# Altium project QUTMS_SteeringWheelV2-V01.PrjPcb
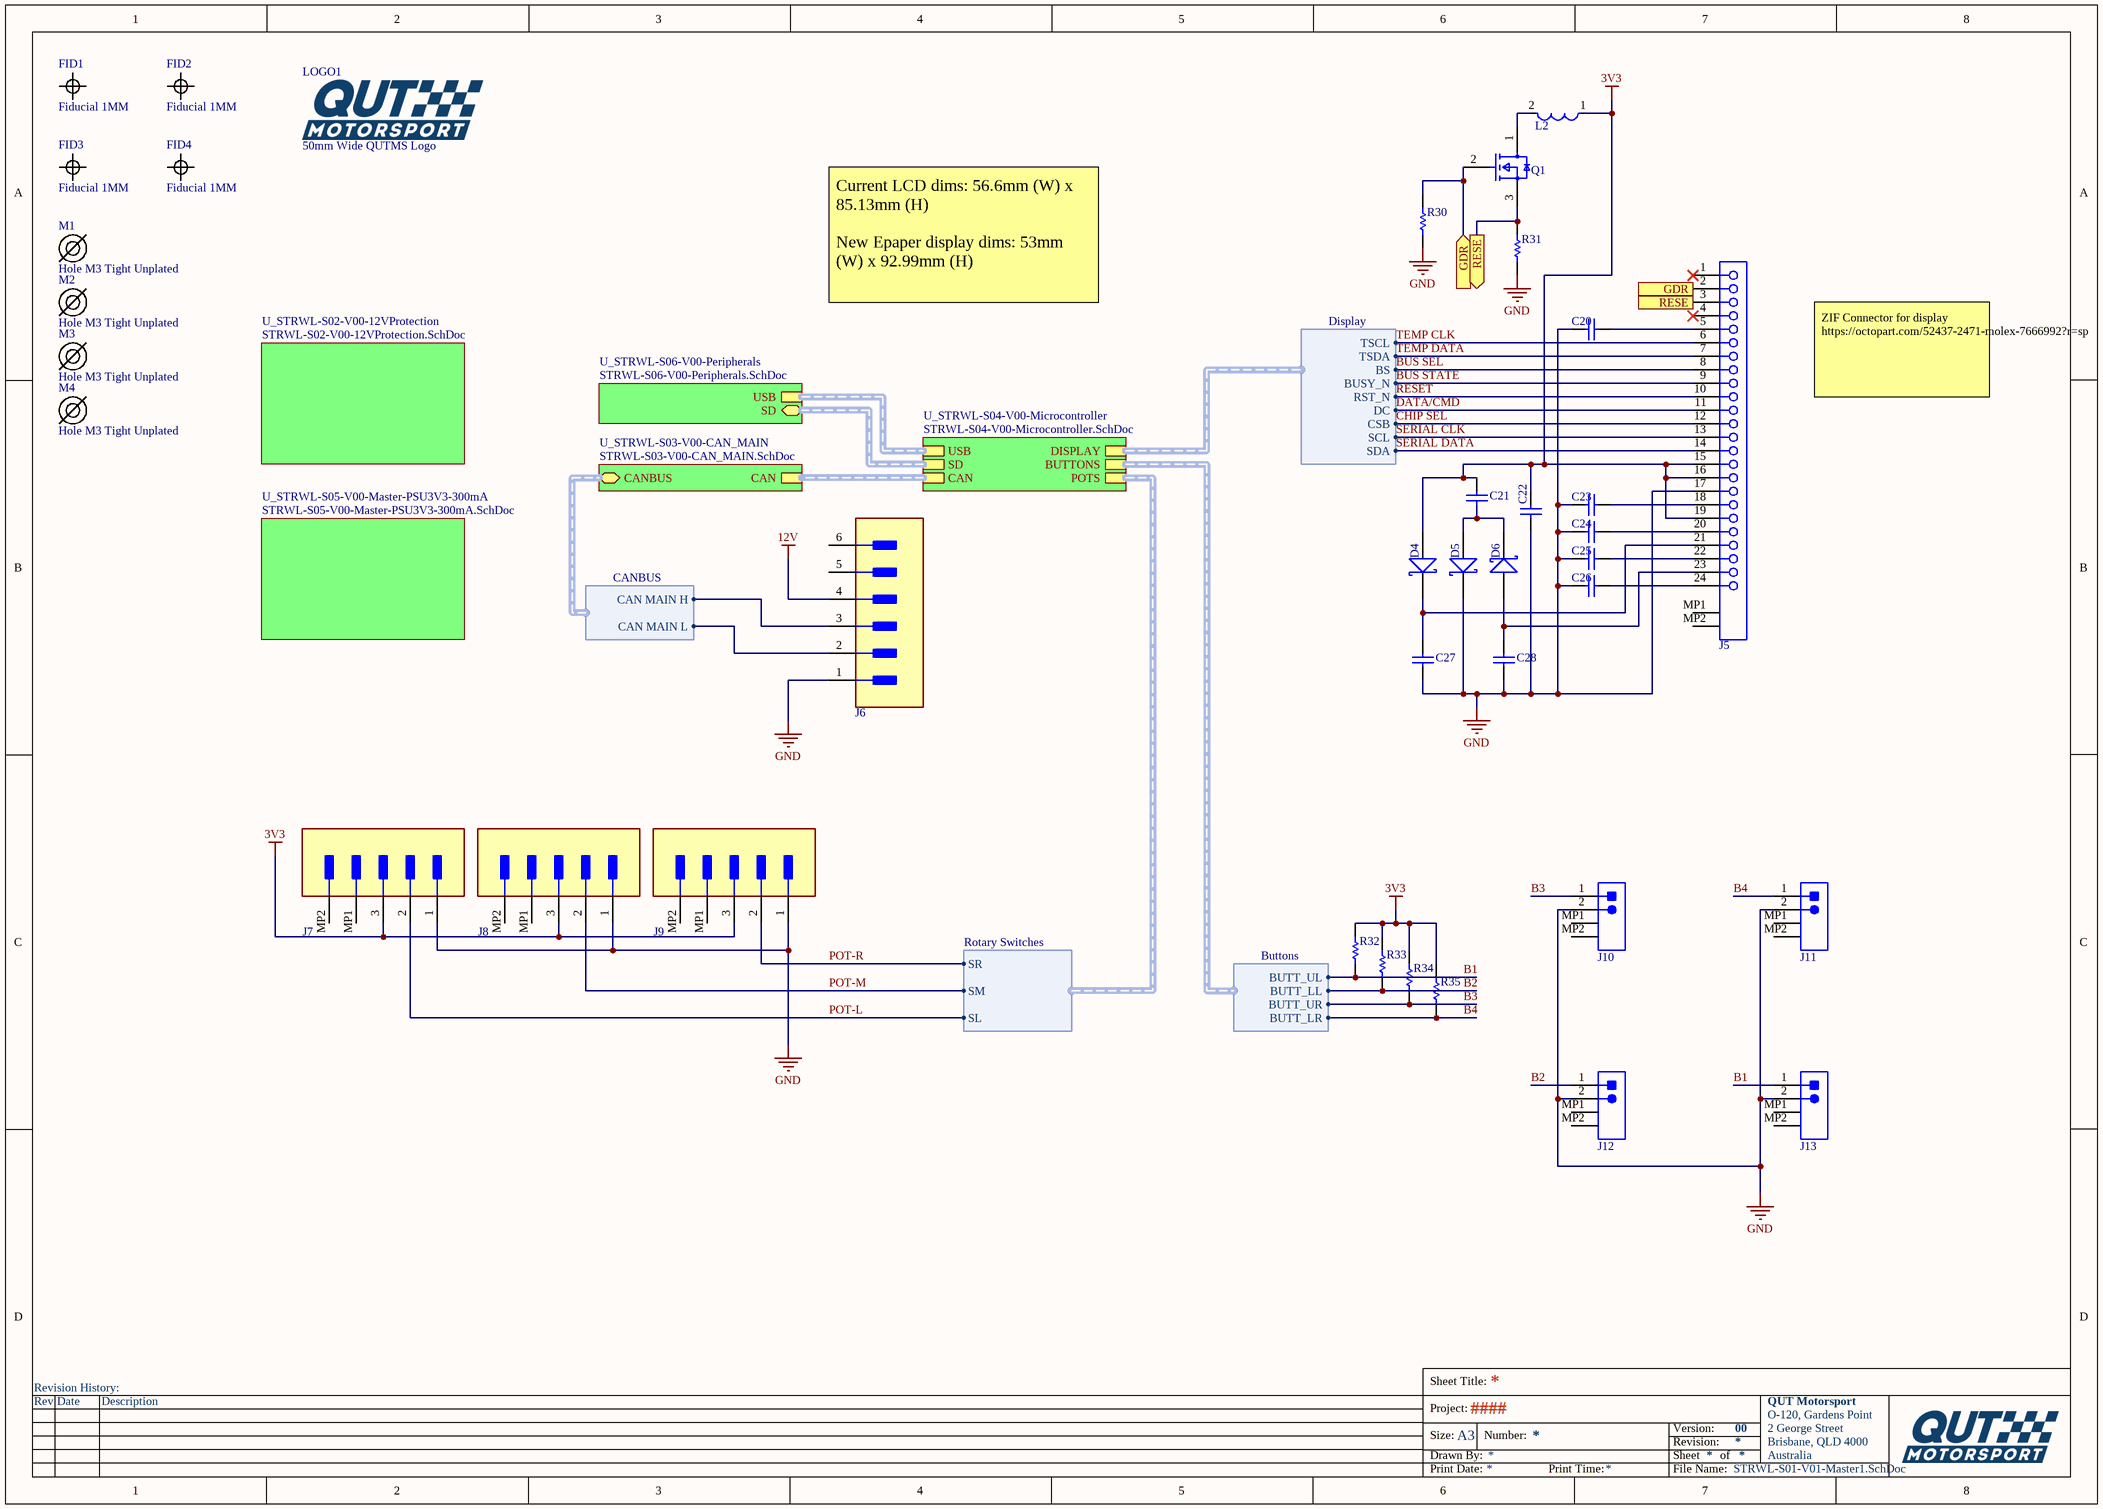
[diagram p0: STRWL-S01-V01-Master1.SchDoc]
4 sheets, 92 parts. Net scope: hierarchical (ports join the sheet entries above them; power ports are global).
Board file: STRWL-P01-V01.PcbDoc
Sheets:
  STRWL-S01-V01-Master1.SchDoc
    U_STRWL-S02-V00-12VProtection = STRWL-S02-V00-12VProtection.SchDoc
    U_STRWL-S03-V00-CAN_MAIN = STRWL-S03-V00-CAN_MAIN.SchDoc
    U_STRWL-S04-V00-Microcontroller = STRWL-S04-V00-Microcontroller.SchDoc

## Sheet STRWL-S01-V01-Master1.SchDoc
size A3; Version: 00; Project: ####; PageSetup: Record=PageOptions|CenterHorizontal=True|CenterVertical=True|PrintScale=0.97|XCorrection=1.00|YCorrection=1.00|PrintKind=0|BorderSize=5000000|LeftOffset=0|BottomOffset=0|Orientation=2|PaperLength=1000|PaperWidth=1000|Scale=100|PaperSource=7|PrintQuality=-4|MediaType=1|DitherType=10|PaperKind=A4|PrintScaleMode=1

### Parts
C20  1uF 25V 5% X7R 0603  [Cap_Ceramic_0603]  (value not drawn)
C21  4u7 50V 5% X7R 0603  [Cap_Ceramic_0603]  (value not drawn)
C22  1uF 25V 5% X7R 0603  [Cap_Ceramic_0603]  (value not drawn)
C23  1uF 25V 5% X7R 0603  [Cap_Ceramic_0603]  (value not drawn)
C24  1uF 25V 5% X7R 0603  [Cap_Ceramic_0603]  (value not drawn)
C25  1uF 25V 5% X7R 0603  [Cap_Ceramic_0603]  (value not drawn)
C26  1uF 25V 5% X7R 0603  [Cap_Ceramic_0603]  (value not drawn)
C27  1uF 25V 5% X7R 0603  [Cap_Ceramic_0603]  (value not drawn)
C28  1uF 25V 5% X7R 0603  [Cap_Ceramic_0603]  (value not drawn)
D4  STPS0530Z  [SOD123]  (value not drawn)
D5  STPS0530Z  [SOD123]  (value not drawn)
D6  STPS0530Z  [SOD123]  (value not drawn)
FID1  Fiducial 1MM  [FIDUCIAL 1MM]  (no BOM)
FID2  Fiducial 1MM  [FIDUCIAL 1MM]  (no BOM)
FID3  Fiducial 1MM  [FIDUCIAL 1MM]  (no BOM)
FID4  Fiducial 1MM  [FIDUCIAL 1MM]  (no BOM)
J5  52437-2471  [MOLX-52437-2471]  (value not drawn)
J6  JST PH 4 Way SMD Header  [JST 4P SMD]  (value not drawn)
J7  JST PH 3 Way SMD Header  [JST 3P SMD]  (value not drawn)
J8  JST PH 3 Way SMD Header  [JST 3P SMD]  (value not drawn)
J9  JST PH 3 Way SMD Header  [JST 3P SMD]  (value not drawn)
J10  JST PH 2 Way SMD Header  [JST 2P SMD]  (value not drawn)
J11  JST PH 2 Way SMD Header  [JST 2P SMD]  (value not drawn)
J12  JST PH 2 Way SMD Header  [JST 2P SMD]  (value not drawn)
J13  JST PH 2 Way SMD Header  [JST 2P SMD]  (value not drawn)
L2  LQM21FN100M70L  [Murata_LQM21FN_70_IPC_C]  (value not drawn)
LOGO1  50mm Wide QUTMS Logo  [QUTMS LOGO 50MM]  (no BOM)
M1  Hole M3 Tight Unplated  [M3.2 UNPLATED]
M2  Hole M3 Tight Unplated  [M3.2 UNPLATED]
M3  Hole M3 Tight Unplated  [M3.2 UNPLATED]
M4  Hole M3 Tight Unplated  [M3.2 UNPLATED]
Q1  MOSFET N-CH 30V 4A SOT323  [Diodes_SOT323_0]  (value not drawn)
R30  10k 1% 0603  [Res_ThinFilm_0603]  (value not drawn)
R31  0R47 5% 0603  [Res_ThinFilm_0603]  (value not drawn)
R32  10k 5% 0603  [Res_ThinFilm_0603]  (value not drawn)
R33  10k 5% 0603  [Res_ThinFilm_0603]  (value not drawn)
R34  10k 5% 0603  [Res_ThinFilm_0603]  (value not drawn)
R35  10k 5% 0603  [Res_ThinFilm_0603]  (value not drawn)

### Sub-sheets
U_STRWL-S02-V00-12VProtection = STRWL-S02-V00-12VProtection.SchDoc: no entries
U_STRWL-S03-V00-CAN_MAIN = STRWL-S03-V00-CAN_MAIN.SchDoc: CANBUS (bidir, harness CANBUS), CAN (harness CAN)
U_STRWL-S04-V00-Microcontroller = STRWL-S04-V00-Microcontroller.SchDoc: CAN (harness CAN), USB (harness USB), SD (harness SD), DISPLAY (harness Display), BUTTONS (harness Buttons), POTS (harness Rotary Switches)
U_STRWL-S05-V00-Master-PSU3V3-300mA = STRWL-S05-V00-Master-PSU3V3-300mA.SchDoc (file not in this document): no entries
U_STRWL-S06-V00-Peripherals = STRWL-S06-V00-Peripherals.SchDoc (file not in this document): USB (harness USB), SD (bidir, harness SD)

### Ports
GDR (in), GDR (out), RESE (in), RESE (out)

### Harnesses
CANBUS: CAN MAIN H, CAN MAIN L
Display: CSB, SCL, SDA, TSCL, TSDA, BS, BUSY_N, RST_N, DC
Buttons: BUTT_UL, BUTT_LL, BUTT_UR, BUTT_LR
Rotary Switches: SL, SM, SR

### Nets
3V3: C21.2 C22.2 D4.A J5.15 J5.16 J5.19 J7.3 J8.3 J9.3 L2.1 R32.1 R33.1 R34.2 R35.2
12V: J6.4
GND: C20.1 C22.1 C23.1 C24.1 C25.1 C26.1 C27.1 C28.1 D5.K J5.17 J6.1 J7.1 J8.1 J9.1 J10.2 J11.2 J12.2 J13.2 R30.2 R31.1
B1: J13.1 R32.2 ; sheet U_STRWL-S04-V00-Microcontroller/BUTTONS.BUTT_UL
B2: J12.1 R33.2 ; sheet U_STRWL-S04-V00-Microcontroller/BUTTONS.BUTT_LL
B3: J10.1 R34.1 ; sheet U_STRWL-S04-V00-Microcontroller/BUTTONS.BUTT_UR
B4: J11.1 R35.1 ; sheet U_STRWL-S04-V00-Microcontroller/BUTTONS.BUTT_LR
BUS SEL: J5.8 ; sheet U_STRWL-S04-V00-Microcontroller/DISPLAY.BS
BUS STATE: J5.9 ; sheet U_STRWL-S04-V00-Microcontroller/DISPLAY.BUSY_N
CAN MAIN H: J6.3 ; sheet U_STRWL-S03-V00-CAN_MAIN/CANBUS.CAN MAIN H
CAN MAIN L: J6.2 ; sheet U_STRWL-S03-V00-CAN_MAIN/CANBUS.CAN MAIN L
CHIP SEL: J5.12 ; sheet U_STRWL-S04-V00-Microcontroller/DISPLAY.CSB
DATA/CMD: J5.11 ; sheet U_STRWL-S04-V00-Microcontroller/DISPLAY.DC
POT-L: J7.2 ; sheet U_STRWL-S04-V00-Microcontroller/POTS.SL
POT-M: J8.2 ; sheet U_STRWL-S04-V00-Microcontroller/POTS.SM
POT-R: J9.2 ; sheet U_STRWL-S04-V00-Microcontroller/POTS.SR
RESET: J5.10 ; sheet U_STRWL-S04-V00-Microcontroller/DISPLAY.RST_N
SERIAL CLK: J5.13 ; sheet U_STRWL-S04-V00-Microcontroller/DISPLAY.SCL
SERIAL DATA: J5.14 ; sheet U_STRWL-S04-V00-Microcontroller/DISPLAY.SDA
TEMP CLK: J5.6 ; sheet U_STRWL-S04-V00-Microcontroller/DISPLAY.TSCL
TEMP DATA: J5.7 ; sheet U_STRWL-S04-V00-Microcontroller/DISPLAY.TSDA
NetC20_2: C20.2 J5.5
NetC21_1: C21.1 D5.A D6.K
NetC23_2: C23.2 J5.18
NetC24_2: C24.2 J5.20
NetC25_2: C25.2 J5.22
NetC26_2: C26.2 J5.24
NetC27_2: C27.2 D4.K J5.21
NetC28_2: C28.2 D6.A J5.23
NetJ5_2: J5.2 Q1.2(G) R30.1 ; port GDR
NetJ5_3: J5.3 Q1.3(S) R31.2 ; port RESE
NetL2_2: L2.2 Q1.1(D)

Not connected (* = marked no-connect by the designer): J5 1* 4* MP1 MP2; J6 5(MNT_1) 6(MNT_2); J7 MP1(MNT_1) MP2(MNT_2); J8 MP1(MNT_1) MP2(MNT_2); J9 MP1(MNT_1) MP2(MNT_2); J10 MP1 MP2; J11 MP1 MP2; J12 MP1 MP2; J13 MP1 MP2

### Buses and harness runs
harness sheet U_STRWL-S03-V00-CAN_MAIN/CAN = sheet U_STRWL-S04-V00-Microcontroller/CAN
harness sheet U_STRWL-S04-V00-Microcontroller/SD = sheet U_STRWL-S06-V00-Peripherals/SD
harness sheet U_STRWL-S04-V00-Microcontroller/USB = sheet U_STRWL-S06-V00-Peripherals/USB

### Notes on the sheet
- Current LCD dims: 56.6mm (W) x 85.13mm (H)
  New Epaper display dims: 53mm (W) x 92.99mm (H)
- ZIF Connector for display
  https://octopart.com/52437-2471-molex-7666992?r=sp
- Revision History:
- Sheet Title:
- Rev
- Date
- Description
- Project:
- Size:
- Drawn By:
- A3
- Number:
- Revision:
- Sheet
- Version:
- of
- QUT Motorsport
- O-120, Gardens Point
- 2 George Street
- Brisbane, QLD 4000
- Australia
- Print Date:
- Print Time:
- File Name:

### Library data of the parts
C20 C22-C28 = 1uF 25V 5% X7R 0603: Capacitor, Ceramic, SMD, 1uF, 25V, 5%, X7R, 0603
C21 = 4u7 50V 5% X7R 0603: Capacitor, Ceramic, SMD, 4u7, 50V, 5%, X7R, 0603
D4-D6 = STPS0530Z: Diode, Schottky Barrier Rectifier, 30 V, 0.5 A, STPS0530Z
J5 = 52437-2471: 0.5 mm Pitch Easy-On(TM) Type FPC Connector, Right Angle, ZIF, SMT, Bottom Contact, 24 Circuits, -40 to 85 degC, ELV and RoHS Compliant, Tape and Reel; Manufacturer: Molex; Durability (mating cycles max): 20; Material - Metal: Phosphor Bronze; Polarized to PCB: Yes; Voltage (Max): 50V; Entry Angle: 90degrees Angle; PCB Locator: No; Material - Plating Termination: Gold; Current (Max per Contact): 0.5A; PCB Retention: None; Pitch - Mating Interface: 0.50mm; Circuits (Loaded): 24; Contact Position: Bottom; PartNumber: 52437-2471; ComponentLink1Description: Manufacturer URL; ComponentLink2Description: Datasheet; ComponentLink3URL: http://www.molex.com/pdm_docs/sd/524372471_sd.pdf; ComponentLink3Description: Package Specification; ComponentLink1URL: http://www.molex.com/molex/index.jsp; Packing: Tape and Reel; Number of Rows: 1; ComponentLink2URL: http://www.molex.com/webdocs/datasheets/pdf/en-us/0524372471_FFC_FPC_CONNECTORS.pdf; PackageVersion: Rev. E, 07/2013; RoHS: TRUE; Material - Plating Mating: Gold; Orientation: Right Angle; Stackable: No; Mounting Technology: Surface Mount; PackageReference: 52437-2471; PackageDescription: 24-Lead FPC Connector, Pitch 0.5 mm
J10-J13 = JST PH 2 Way SMD Header: PartNumber: S2B-PH-SM4-TB(LF)(SN); Current Rating: 3 A; RoHSCompliant: True; Min Operating Temperature: -65degC; Width: 2.34 mm; Pins: 40; ComponentLink1Description: Manufacturer URL; ComponentLink2Description: Datasheet; DatasheetVersion: Dec-12; ComponentLink1URL: http://www.jst.com/home2.html; Contact Plating: Tin; ComponentLink2URL: http://www.jst-mfg.com/product/pdf/eng/ePH.pdf; PackageReference: S2B-PH-SM4-TB(LF)(SN)-2; Mount: Through Hole; Contact Finish: Lead; Length: 101.19 mm; Radiation Hardening: No; Lead Pitch: 0.1 inch; Max Operating Temperature: 105degC; Colour: Black; Package Quantity: 100; Height: 8.13 mm; Packaging: Bulk; PackageDescription: Male Header, Pitch 2 mm, 1 x 2 Position, Height 5.5 mm; Contact Material: Bronze
LOGO1 = QUTMS Logo 50mm
M1-M4 = Hole M3 Tight Unplated: M3.2 Hole, No Plating
Q1 = DMN3065LW-13: N-Channel 30V 4A (Ta) 770mW (Ta) Surface Mount SOT-323
R30 = 10k 1% 0603: Resistor, SMD, 10k, 0.1W, 1%, 0603
R31 = 0R47 5% 0603_1: Resistor, SMD, 0R, 0.1W, 5%, 0603
R32-R35 = 10k 5% 0603: Resistor, SMD, 10k, 0.1W, 5%, 0603

## Sheet STRWL-S02-V00-12VProtection.SchDoc: 12V Protected Input
size A3; SheetNumber: 2; SheetTotal: 7
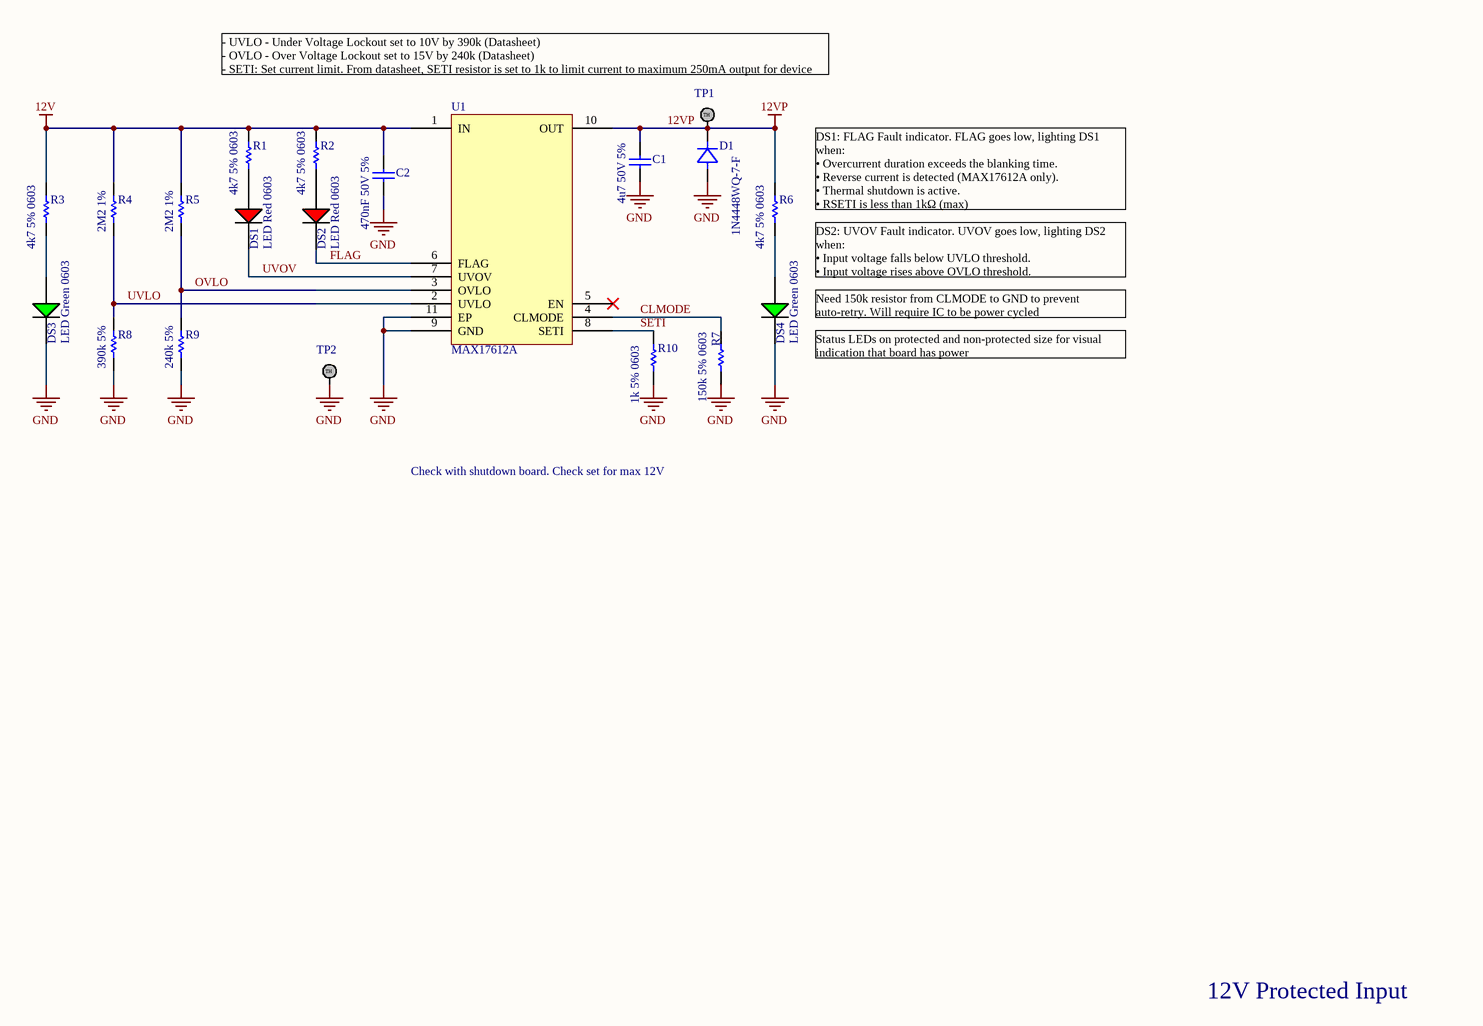
[diagram p1: STRWL-S02-V00-12VProtection.SchDoc]

### Parts
C1  4u7 50V 5%  [Cap_Ceramic_0603]
C2  470nF 50V 5%  [Cap_Ceramic_0603]
D1  1N4448WQ-7-F  [SMA]
DS1  LED Red 0603  [LED RED 0603]
DS2  LED Red 0603  [LED RED 0603]
DS3  LED Green 0603  [LED GREEN 0603]
DS4  LED Green 0603  [LED GREEN 0603]
R1  4k7 5% 0603  [Res_ThinFilm_0603]
R2  4k7 5% 0603  [Res_ThinFilm_0603]
R3  4k7 5% 0603  [Res_ThinFilm_0603]
R4  2M2 1%  [Res_ThinFilm_0603]
R5  2M2 1%  [Res_ThinFilm_0603]
R6  4k7 5% 0603  [Res_ThinFilm_0603]
R7  150k 5% 0603  [Res_ThinFilm_0603]
R8  390k 5%  [Res_ThinFilm_0603]
R9  240k 5%  [Res_ThinFilm_0603]
R10  1k 5% 0603  [Res_ThinFilm_0603]
TP1  TestPoint  [TestPointSMD]  (value not drawn)
TP2  TestPoint  [TestPointSMD]  (value not drawn)
U1  MAX17612A  [MAX17612A]

### Nets
12V: C2.2 R1.2 R2.2 R3.2 R4.2 R5.2 U1.1(IN)
12VP: C1.2 D1.K(Cathode) R6.2 TP1.1 U1.10(OUT)
GND: C1.1 C2.1 D1.A(Anode) DS3.2(C) DS4.2(C) R7.1 R8.1 R9.1 R10.1 TP2.1 U1.9(GND) U1.11(EP)
CLMODE: R7.2 U1.4(CLMODE)
FLAG: DS2.2(C) U1.6(FLAG)
OVLO: R5.1 R9.2 U1.3(OVLO)
SETI: R10.2 U1.8(SETI)
UVLO: R4.1 R8.2 U1.2(UVLO)
UVOV: DS1.2(C) U1.7(UVOV)
NetDS1_1: DS1.1(A) R1.1
NetDS2_1: DS2.1(A) R2.1
NetDS3_1: DS3.1(A) R3.1
NetDS4_1: DS4.1(A) R6.1

Not connected (* = marked no-connect by the designer): U1 5(EN)*

### Notes on the sheet
- - UVLO - Under Voltage Lockout set to 10V by 390k (Datasheet)
  - OVLO - Over Voltage Lockout set to 15V by 240k (Datasheet)
  - SETI: Set current limit. From datasheet, SETI resistor is set to 1k to limit current to maximum 250mA output for device
- (near R6) DS1: FLAG Fault indicator. FLAG goes low, lighting DS1 when:
  • Overcurrent duration exceeds the blanking time.
  • Reverse current is detected (MAX17612A only).
  • Thermal shutdown is active.
  • RSETI is less than 1kΩ (max)
- DS2: UVOV Fault indicator. UVOV goes low, lighting DS2 when:
  • Input voltage falls below UVLO threshold.
  • Input voltage rises above OVLO threshold.
- (near DS4) Need 150k resistor from CLMODE to GND to prevent auto-retry. Will require IC to be power cycled
- (near DS4) Status LEDs on protected and non-protected size for visual indication that board has power
- Check with shutdown board. Check set for max 12V
- 12V Protected Input
- (in symbol TestPoint) TH

### Library data of the parts
C1 = 4u7 50V 5% X7R 0603: as C21 on sheet STRWL-S01-V01-Master1
C2 = 470nF 50V 5% X7R 0603: Capacitor, Ceramic, SMD, 470nF, 50V, 5%, X7R, 0603
D1 = 1N4448WQ-7-F: Diode, SMD, 75V, 5%, 250mA, SOD123; Manufacturer: ON Semiconductor / Fairchild; Manufacturer Part Number: 1N914BWS; Average Rectified Current: 150mA; Element Configuration: Single; Forward Voltage: 1V; Max Reverse Leakage Current: 5uA; Power Dissipation: 200mW; Recovery Time: 4ns; Max Forward Surge Current (Ifsm): 4A; Parameter 1: *; Weight: 0.0276g; Category: Rectifier Diodes; Contact Plating: Tin,Matte; Forward Current: 150mA; Lead Free: Lead Free; Max Operating Temperature: 150°C; Max Repetitive Reverse Voltage (Vrrm): 75V; Max Reverse Voltage (DC): 75V; Min Operating Temperature: -55°C; Mount: Surface Mount; Number of Pins: 2; Package Quantity: 1; Packaging: Tape and Reel; Peak Reverse Current: 5uA; Radiation Hardening: No; REACH SVHC: No SVHC; Reverse Recovery Time: 4ns; Height: 1mm; Length: 1.8mm; Reverse Voltage: 75V; Width: 1.35mm
R1-R3 R6 = 4k7 5% 0603: Resistor, SMD, 4k7, 0.1W, 5%, 0603
R4 R5 = 2M2 1% 0603: Resistor, SMD, 2M2, 0.125W, 1%, 0603
R7 = 150k 5%, 0603: Resistor, SMD, 150k, 0.1W, 5%, 0603
R8 = 390k 5% 0603: Resistor, SMD, 390k, 0.1W, 5%, 0603
R9 = 240k 5% 0603: Resistor, SMD, 240k, 0.1W, 5%, 0603
R10 = 1k 5% 0603: Resistor, SMD, 1k, 0.1W, 5%, 0603
U1 = MAX17612A: 4.5V to 60V, 250mA Current-Limiter with OV, UV, and Reverse Protection; ComponentLink1Description: Datasheet; ComponentLink1URL: https://datasheets.maximintegrated.com/en/ds/MAX17612A-MAX17612C.pdf

## Sheet STRWL-S03-V00-CAN_MAIN.SchDoc
size A3; SheetNumber: 3; SheetTotal: 6
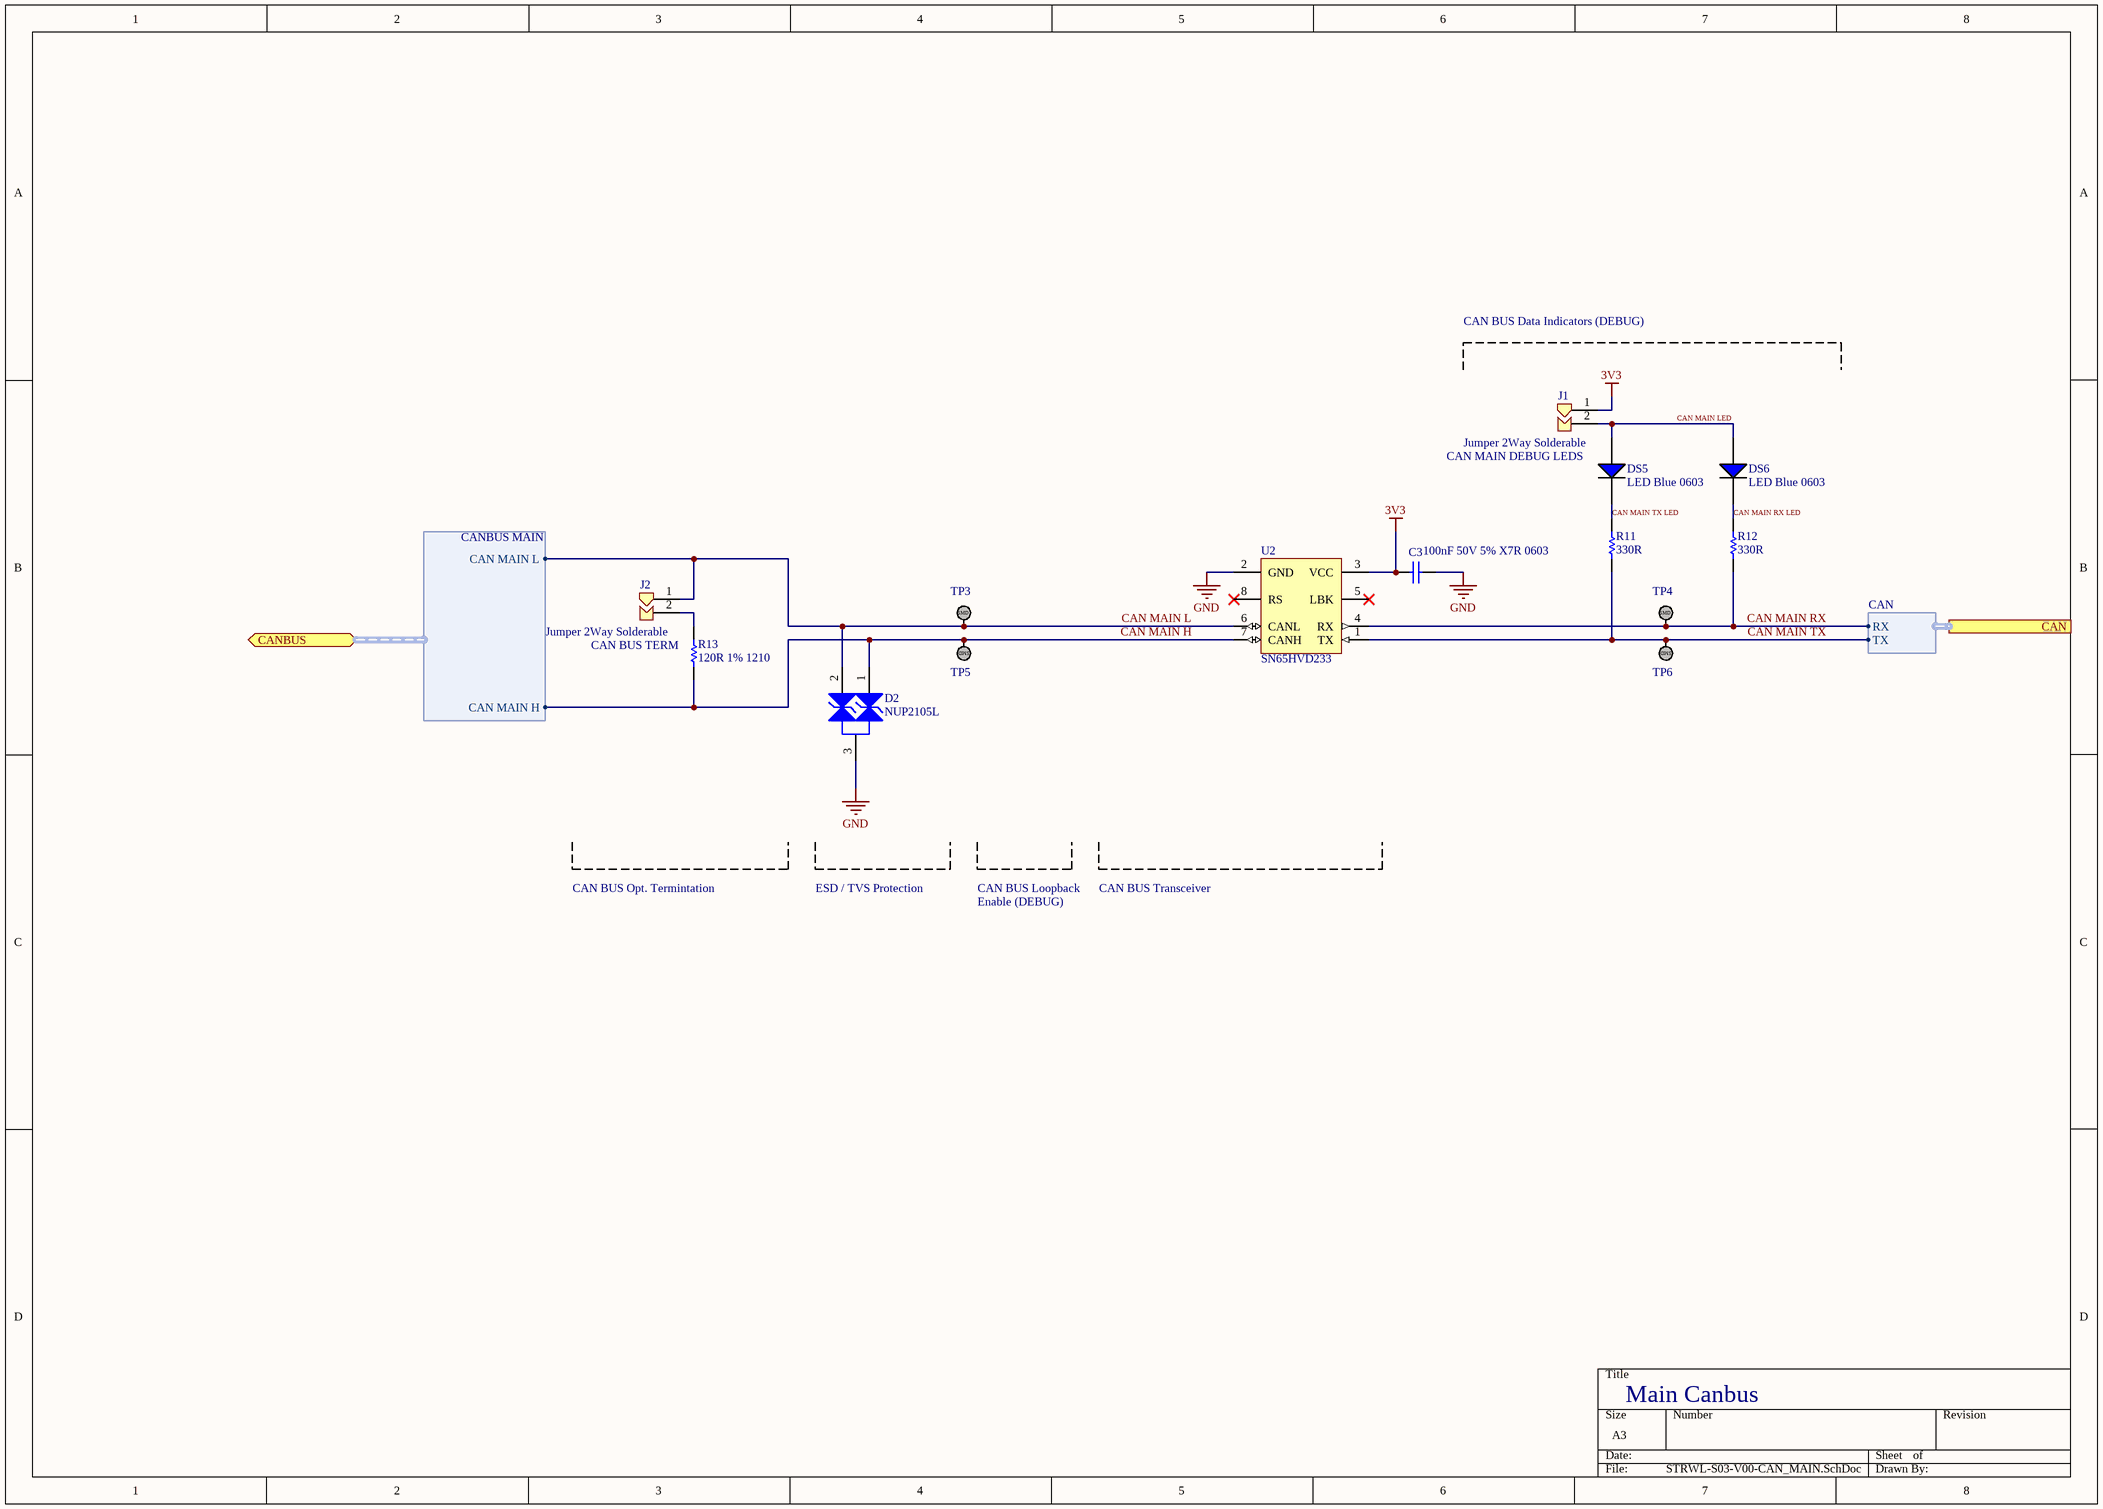
[diagram p2: STRWL-S03-V00-CAN_MAIN.SchDoc]

### Parts
C3  100nF 50V 5% X7R 0603  [Cap_Ceramic_0603]
D2  NUP2105L  [NUP2105L]
DS5  LED Blue 0603  [LED BLUE 0603]
DS6  LED Blue 0603  [LED BLUE 0603]
J1  Jumper 2Way Solderable  [Jumper_2Way_Solderable]
J2  Jumper 2Way Solderable  [Jumper_2Way_Solderable]
R11  330R  [Res_ThinFilm_0603]
R12  330R  [Res_ThinFilm_0603]
R13  120R 1% 1210  [Res_ThinFilm_1210]
TP3  TestPoint_SMD  [TestPointSMD]  (value not drawn)
TP4  TestPoint_SMD  [TestPointSMD]  (value not drawn)
TP5  TestPoint_SMD  [TestPointSMD]  (value not drawn)
TP6  TestPoint_SMD  [TestPointSMD]  (value not drawn)
U2  SN65HVD233  [SN65HVD233DR]

### Ports
CAN (harness CAN), CANBUS (bidir, harness CANBUS MAIN)

### Harnesses
CANBUS MAIN: CAN MAIN L, CAN MAIN H
CAN: TX, RX

### Nets
3V3: C3.1 J1.1 U2.3(VCC)
GND: C3.2 D2.3 U2.2(GND)
CAN MAIN H: D2.1 R13.1 TP5.1 U2.7(CANH) ; port CANBUS.CAN MAIN H
CAN MAIN L: D2.2 J2.1 TP3.1 U2.6(CANL) ; port CANBUS.CAN MAIN L
CAN MAIN LED: DS5.1(A) DS6.1(A) J1.2
CAN MAIN RX: R12.1 TP4.1 U2.4(RX) ; port CAN.RX  [project net CAN GLV RX]
CAN MAIN RX LED: DS6.2(C) R12.2
CAN MAIN TX: R11.1 TP6.1 U2.1(TX) ; port CAN.TX  [project net CAN GLX TX]
CAN MAIN TX LED: DS5.2(C) R11.2
NetJ2_2: J2.2 R13.2

Not connected (* = marked no-connect by the designer): U2 5(LBK)* 8(RS)*

### Notes on the sheet
- CAN BUS Data Indicators (DEBUG)
- CAN MAIN DEBUG LEDS
- (near R13) CAN BUS TERM
- CAN BUS Opt. Termintation
- ESD / TVS Protection
- CAN BUS Loopback
- Enable (DEBUG)
- CAN BUS Transceiver
- Main Canbus
- (in symbol TestPoint_SMD) SMD

### Library data of the parts
C3 = 100nF 50V 5% X7R 0603: Capacitor, Ceramic, SMD, 100nF, 50V, 5%, X7R, 0603
J1 J2 = Jumper 2Way Side Solderable
R11 R12 = 330R 5% 0603: Resistor, SMD, 330R, 0.1W, 5%, 0603
R13 = 120R 1% 1210: Resistor, SMD, 120R, 0.25W, 1%, 1210
D2 = NUP2105L: ComponentLink1Description: Datasheet; ComponentLink1URL: https://www.onsemi.cn/PowerSolutions/document/NUP2105L-D.PDF; Parameter 1: *; ComponentLink2Description: LCSC; ComponentLink2URL: https://lcsc.com/product-detail/TVS_ON-Semiconductor-NUP2105LT1G_C14486.html; ComponentLink3Description: Digikey; ComponentLink3URL: https://www.digikey.com.au/product-detail/en/on-semiconductor/SZNUP2105LT1G/SZNUP2105LT1GOSCT-ND/3487669
U2 = SN65HVD233: ComponentLink1Description: LCSC; ComponentLink1URL: https://lcsc.com/product-detail/CAN-ICs_Texas-Instruments_SN65HVD233DRG4_Texas-Instruments-Texas-Instruments-SN65HVD233DRG4_C61643.html; ComponentLink2Description: Digikey; ComponentLink2URL: https://www.digikey.com.au/product-detail/en/texas-instruments/SN65HVD233DR/296-35967-1-ND/4134960; ComponentLink3Description: Datasheet; ComponentLink3URL: https://www.ti.com/lit/ds/symlink/sn65hvd233.pdf?ts=1588560888178; ComponentLink4Description: Ti Product Page; ComponentLink4URL: https://www.ti.com/product/SN65HVD233

## Sheet STRWL-S04-V00-Microcontroller.SchDoc: STRWL Microcontroller
size A3; DrawnBy: John Hatfield; DocumentNumber: 4; Revision: 01; SheetNumber: 4; SheetTotal: 6; Version: 01; Project: STRWL QEV3; PageSetup: Record=PageOptions|CenterHorizontal=True|CenterVertical=True|PrintScale=0.97|XCorrection=1.00|YCorrection=1.00|PrintKind=0|BorderSize=5000000|LeftOffset=0|BottomOffset=0|Orientation=2|PaperLength=1000|PaperWidth=1000|Scale=100|PaperSource=7|PrintQuality=-4|MediaType=1|DitherType=10|PaperKind=A4|PrintScaleMode=1
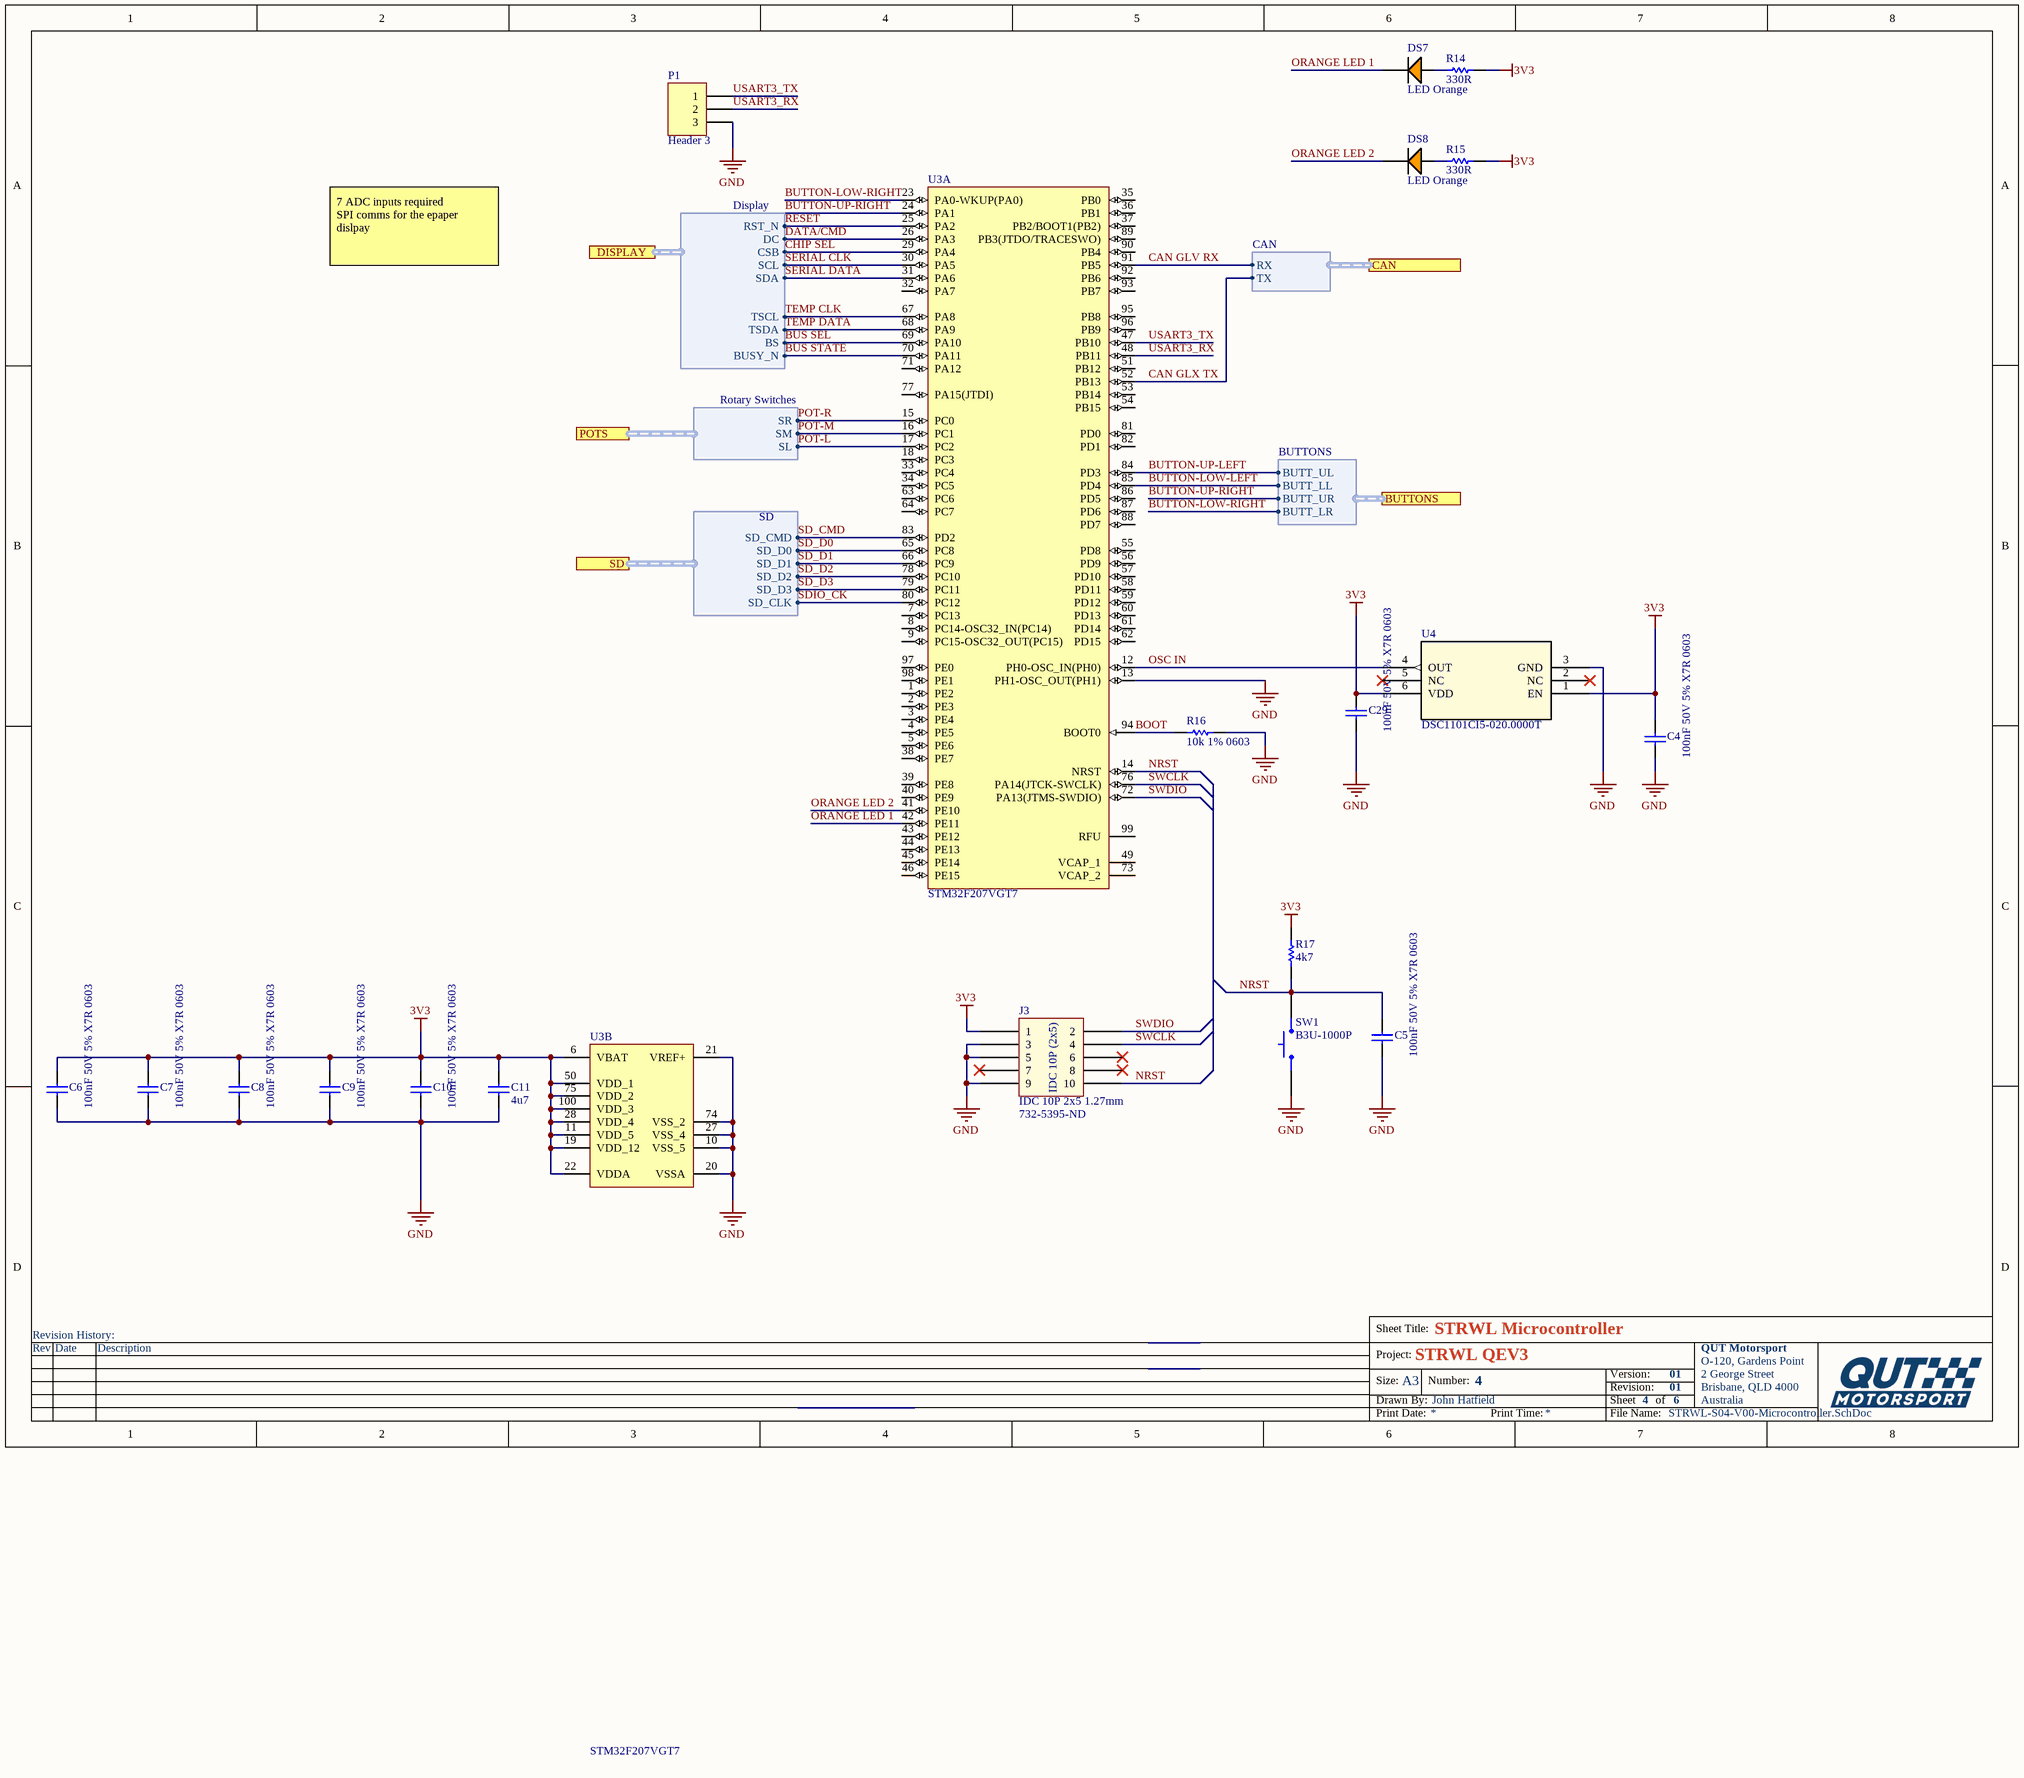
[diagram p3: STRWL-S04-V00-Microcontroller.SchDoc]

### Parts
C4  100nF 50V 5% X7R 0603  [Cap_Ceramic_0603]
C5  100nF 50V 5% X7R 0603  [Cap_Ceramic_0603]
C6  100nF 50V 5% X7R 0603  [Cap_Ceramic_0603]
C7  100nF 50V 5% X7R 0603  [Cap_Ceramic_0603]
C8  100nF 50V 5% X7R 0603  [Cap_Ceramic_0603]
C9  100nF 50V 5% X7R 0603  [Cap_Ceramic_0603]
C10  100nF 50V 5% X7R 0603  [Cap_Ceramic_0603]
C11  4u7  [Cap_Ceramic_0603]
C29  100nF 50V 5% X7R 0603  [Cap_Ceramic_0603]
DS7  LED Orange  [LED ORANGE 0603]
DS8  LED Orange  [LED ORANGE 0603]
J3  IDC 10P 2x5 1.27mm  [IDC 1.27MM 10P]
P1  Header 3  [HDR1X3]
R14  330R  [Res_ThinFilm_0603]
R15  330R  [Res_ThinFilm_0603]
R16  10k 1% 0603  [Res_ThinFilm_0603]
R17  4k7  [Res_ThinFilm_0603]
SW1  B3U-1000P  [BTN B3U-1000P]
U3  STM32F207VGT7  [STM-LQFP100_N]  (parts A,B of 2)
U4  DSC1101CI5-020.0000T  [VDFN6_3P2X2P5_MCH]

### Ports
BUTTONS (harness BUTTONS), CAN (harness CAN), DISPLAY (harness Display), POTS (harness Rotary Switches), SD (harness SD)

### Harnesses
SD: SD_D0, SD_D1, SD_D2, SD_D3, SD_CLK, SD_CMD
Display: RST_N, DC, CSB, SCL, SDA, TSCL, TSDA, BS, BUSY_N
BUTTONS: BUTT_UL, BUTT_LL, BUTT_UR, BUTT_LR
Rotary Switches: SL, SM, SR
CAN: RX, TX

### Nets
3V3: C4.2 C6.2 C7.2 C8.2 C9.2 C10.2 C11.2 C29.2 J3.1 R14.2 R15.2 R17.2 U3.6(VBAT) U3.11(VDD_5) U3.19(VDD_12) U3.22(VDDA) U3.28(VDD_4) U3.50(VDD_1) U3.75(VDD_2) U3.100(VDD_3) U4.1(EN) U4.6(VDD)
GND: C4.1 C5.1 C6.1 C7.1 C8.1 C9.1 C10.1 C11.1 C29.1 J3.3 J3.5 J3.9 P1.3 R16.2 SW1.1 U3.10(VSS_5) U3.13(PH1-OSC_OUT(PH1)) U3.20(VSSA) U3.21(VREF+) U3.27(VSS_4) U3.74(VSS_2) U4.3(GND)
BOOT: R16.1 U3.94(BOOT0)
BUS SEL: U3.69(PA10) ; port DISPLAY.BS
BUS STATE: U3.70(PA11) ; port DISPLAY.BUSY_N
BUTTON-LOW-LEFT: U3.85(PD4) ; port BUTTONS.BUTT_LL  [project net B2]
BUTTON-LOW-RIGHT: U3.23(PA0-WKUP(PA0)) ; port BUTTONS.BUTT_LR  [project net B4]
BUTTON-UP-LEFT: U3.84(PD3) ; port BUTTONS.BUTT_UL  [project net B1]
BUTTON-UP-RIGHT: U3.24(PA1) ; port BUTTONS.BUTT_UR  [project net B3]
CAN GLV RX: U3.91(PB5) ; port CAN.RX
CAN GLX TX: U3.52(PB13) ; port CAN.TX
CHIP SEL: U3.29(PA4) ; port DISPLAY.CSB
DATA/CMD: U3.26(PA3) ; port DISPLAY.DC
NRST: C5.2 J3.10 R17.1 SW1.2 U3.14(NRST)
ORANGE LED 1: DS7.2(C) U3.42(PE11)
ORANGE LED 2: DS8.2(C) U3.41(PE10)
OSC IN: U3.12(PH0-OSC_IN(PH0)) U4.4(OUT)
POT-L: U3.17(PC2) ; port POTS.SL
POT-M: U3.16(PC1) ; port POTS.SM
POT-R: U3.15(PC0) ; port POTS.SR
RESET: U3.25(PA2) ; port DISPLAY.RST_N
SD_CMD: U3.83(PD2) ; port SD.SD_CMD
SD_D0: U3.65(PC8) ; port SD.SD_D0
SD_D1: U3.66(PC9) ; port SD.SD_D1
SD_D2: U3.78(PC10) ; port SD.SD_D2
SD_D3: U3.79(PC11) ; port SD.SD_D3
SDIO_CK: U3.80(PC12) ; port SD.SD_CLK
SERIAL CLK: U3.30(PA5) ; port DISPLAY.SCL
SERIAL DATA: U3.31(PA6) ; port DISPLAY.SDA
SWCLK: J3.4 U3.76(PA14(JTCK-SWCLK))
SWDIO: J3.2 U3.72(PA13(JTMS-SWDIO))
TEMP CLK: U3.67(PA8) ; port DISPLAY.TSCL
TEMP DATA: U3.68(PA9) ; port DISPLAY.TSDA
USART3_RX: P1.2 U3.48(PB11)
USART3_TX: P1.1 U3.47(PB10)
NetDS7_1: DS7.1(A) R14.1
NetDS8_1: DS8.1(A) R15.1

Not connected (* = marked no-connect by the designer): J3 6* 7* 8*; U3 1(PE2) 2(PE3) 3(PE4) 4(PE5) 5(PE6) 7(PC13) 8(PC14-OSC32_IN(PC14)) 9(PC15-OSC32_OUT(PC15)) 18(PC3) 32(PA7) 33(PC4) 34(PC5) 35(PB0) 36(PB1) 37(PB2/BOOT1(PB2)) 38(PE7) 39(PE8) 40(PE9) 43(PE12) 44(PE13) 45(PE14) 46(PE15) 49(VCAP_1) 51(PB12) 53(PB14) 54(PB15) 55(PD8) 56(PD9) 57(PD10) 58(PD11) 59(PD12) 60(PD13) 61(PD14) 62(PD15) 63(PC6) 64(PC7) 71(PA12) 73(VCAP_2) 77(PA15(JTDI)) 81(PD0) 82(PD1) 86(PD5) 87(PD6) 88(PD7) 89(PB3(JTDO/TRACESWO)) 90(PB4) 92(PB6) 93(PB7) 95(PB8) 96(PB9) 97(PE0) 98(PE1) 99(RFU); U4 2(NC)* 5(NC)*

### Notes on the sheet
- 7 ADC inputs required
  SPI comms for the epaper dislpay
- (near J3) 732-5395-ND
- Revision History:
- Sheet Title:
- Rev
- Date
- Description
- Project:
- Size:
- Drawn By:
- A3
- Number:
- Revision:
- Sheet
- Version:
- of
- QUT Motorsport
- O-120, Gardens Point
- 2 George Street
- Brisbane, QLD 4000
- Australia
- Print Date:
- Print Time:
- File Name:
- (in symbol IDC 10P 2x5 1.27mm) IDC 10P (2x5)

### Library data of the parts
C4-C10 C29 = 100nF 50V 5% X7R 0603: as C3 on sheet STRWL-S03-V00-CAN_MAIN
C11 = 4u7 50V 5% X7R 0603: as C21 on sheet STRWL-S01-V01-Master1
DS7 DS8 = LED ORANGE 0603
P1 = Header 3: Header, 3-Pin; LatestRevisionDate: 17-Jul-2002; LatestRevisionNote: Re-released for DXP Platform.; Publisher: Altium Limited
R14 R15 = 330R 5% 0603: Resistor, SMD, 330R, 0.1W, 5%, 0603
R16 = 20k 1% 0603: Resistor, SMD, 20k, 0.1W, 5%, 0603
R17 = 4k7 5% 0603: Resistor, SMD, 4k7, 0.1W, 5%, 0603
SW1 = BTN B3U-1000P: Omron B3U-1000P Ultra Miniture Switch; ComponentLink1Description: LCSC; ComponentLink1URL: https://lcsc.com/product-detail/Tactile-Switches_BRIGHT-TSA063G50-250_C294565.html
U3 = STM32F207VGT7-Custom: ARM Cortex-M3 32-bit MCU, 1024 KB Flash, 128 KB Internal RAM, 82 I/Os, 100-pin LQFP, -40 to 105 degC, Tray; D/A Converter: 2x12-bit (2 Channel); Internal RAM Size (kB): 128; Supply Voltage(Vcc) min (V): 1.8; I/Os (High Current): 82; Operating Frequency(F) (Processor speed) (MHz): 120; FLASH Size (Prog) (kB): 1024; PartNumber: STM32F207VGT7; DatasheetVersion: Rev. 9; Core: ARM Cortex-M3; ComponentLink3Description: Package Specification; ComponentLink3URL: http://www.st.com/st-web-ui/static/active/en/resource/technical/document/data_brief/DM00071938.pdf; PackageDescription: 100-Pin Low Profile Quad Flat Package, 14 x 14 mm Body, 0.5 mm Pitch; ComponentLink1Description: Manufacturer URL; PackageVersion: Rev. 1, 06/2013; ComponentLink1URL: http://www.st.com/web/en/home.html; PackageReference: LQFP100; ComponentLink2Description: Datasheet; ComponentLink2URL: http://www.st.com/st-web-ui/static/active/en/resource/technical/document/datasheet/CD00237391.pdf; Mounting Technology: Surface Mount; Packing: Tray
U4 = DSC1101CI5-020.0000T: No Description Available; Vendor: Microchip; Built_By: EMA_Jessica; SourceLibrary: Microchip_2019-08-23_23; Manufacturer_Part_Number: DSC1101CI5-020.0000T; Copyright: Copyright (C) 2018 Accelerated Designs. All rights reserved; RefDes: RefDes; Type: DEV

## Nets that join several sheets
3V3: STRWL-S01-V01-Master1 (14 pins), STRWL-S03-V00-CAN_MAIN (C3.1 J1.1 U2.3), STRWL-S04-V00-Microcontroller (22 pins)
12V: STRWL-S01-V01-Master1 (J6.4), STRWL-S02-V00-12VProtection (7 pins)
GND: STRWL-S01-V01-Master1 (20 pins), STRWL-S02-V00-12VProtection (12 pins), STRWL-S03-V00-CAN_MAIN (C3.2 D2.3 U2.2), STRWL-S04-V00-Microcontroller (22 pins)
B1: STRWL-S01-V01-Master1 (J13.1 R32.2), STRWL-S04-V00-Microcontroller (U3.84)
B2: STRWL-S01-V01-Master1 (J12.1 R33.2), STRWL-S04-V00-Microcontroller (U3.85)
B3: STRWL-S01-V01-Master1 (J10.1 R34.1), STRWL-S04-V00-Microcontroller (U3.24)
B4: STRWL-S01-V01-Master1 (J11.1 R35.1), STRWL-S04-V00-Microcontroller (U3.23)
BUS SEL: STRWL-S01-V01-Master1 (J5.8), STRWL-S04-V00-Microcontroller (U3.69)
BUS STATE: STRWL-S01-V01-Master1 (J5.9), STRWL-S04-V00-Microcontroller (U3.70)
CAN GLV RX: STRWL-S03-V00-CAN_MAIN (R12.1 TP4.1 U2.4), STRWL-S04-V00-Microcontroller (U3.91)
CAN GLX TX: STRWL-S03-V00-CAN_MAIN (R11.1 TP6.1 U2.1), STRWL-S04-V00-Microcontroller (U3.52)
CAN MAIN H: STRWL-S01-V01-Master1 (J6.3), STRWL-S03-V00-CAN_MAIN (D2.1 R13.1 TP5.1 U2.7)
CAN MAIN L: STRWL-S01-V01-Master1 (J6.2), STRWL-S03-V00-CAN_MAIN (D2.2 J2.1 TP3.1 U2.6)
CHIP SEL: STRWL-S01-V01-Master1 (J5.12), STRWL-S04-V00-Microcontroller (U3.29)
DATA/CMD: STRWL-S01-V01-Master1 (J5.11), STRWL-S04-V00-Microcontroller (U3.26)
POT-L: STRWL-S01-V01-Master1 (J7.2), STRWL-S04-V00-Microcontroller (U3.17)
POT-M: STRWL-S01-V01-Master1 (J8.2), STRWL-S04-V00-Microcontroller (U3.16)
POT-R: STRWL-S01-V01-Master1 (J9.2), STRWL-S04-V00-Microcontroller (U3.15)
RESET: STRWL-S01-V01-Master1 (J5.10), STRWL-S04-V00-Microcontroller (U3.25)
SERIAL CLK: STRWL-S01-V01-Master1 (J5.13), STRWL-S04-V00-Microcontroller (U3.30)
SERIAL DATA: STRWL-S01-V01-Master1 (J5.14), STRWL-S04-V00-Microcontroller (U3.31)
TEMP CLK: STRWL-S01-V01-Master1 (J5.6), STRWL-S04-V00-Microcontroller (U3.67)
TEMP DATA: STRWL-S01-V01-Master1 (J5.7), STRWL-S04-V00-Microcontroller (U3.68)